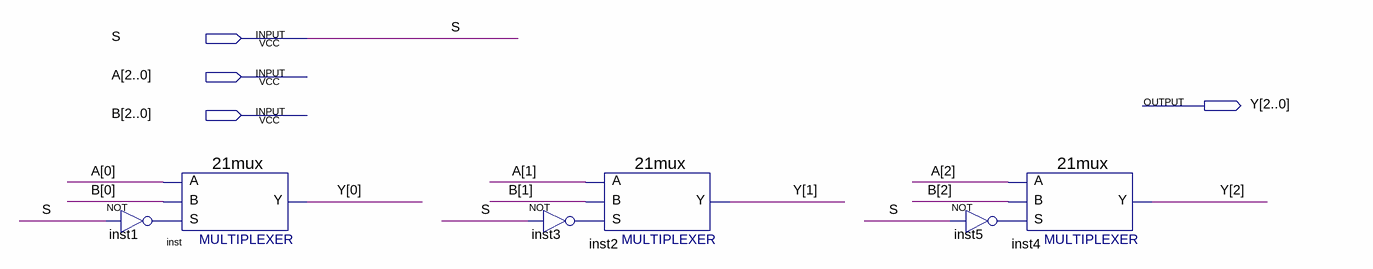
[diagram p0: schematic sheet]
// Quartus schematic mux21_3bit.bdf as structural Verilog: 6 symbols, 4 pins
module mux21_3bit (
  input  S,
  input  [2:0] A,
  input  [2:0] B,
  output [2:0] Y
);

  wire inst1_out, inst3_out, inst5_out;

  \21mux  inst (.S(inst1_out), .B(B[0]), .A(A[0]), .Y(Y[0]));
  not inst1 (inst1_out, S);
  not inst3 (inst3_out, S);
  \21mux  inst2 (.S(inst3_out), .B(B[1]), .A(A[1]), .Y(Y[1]));
  \21mux  inst4 (.S(inst5_out), .B(B[2]), .A(A[2]), .Y(Y[2]));
  not inst5 (inst5_out, S);
endmodule
